# EAGLE design RF-Test-2 (EAGLE 6.4)
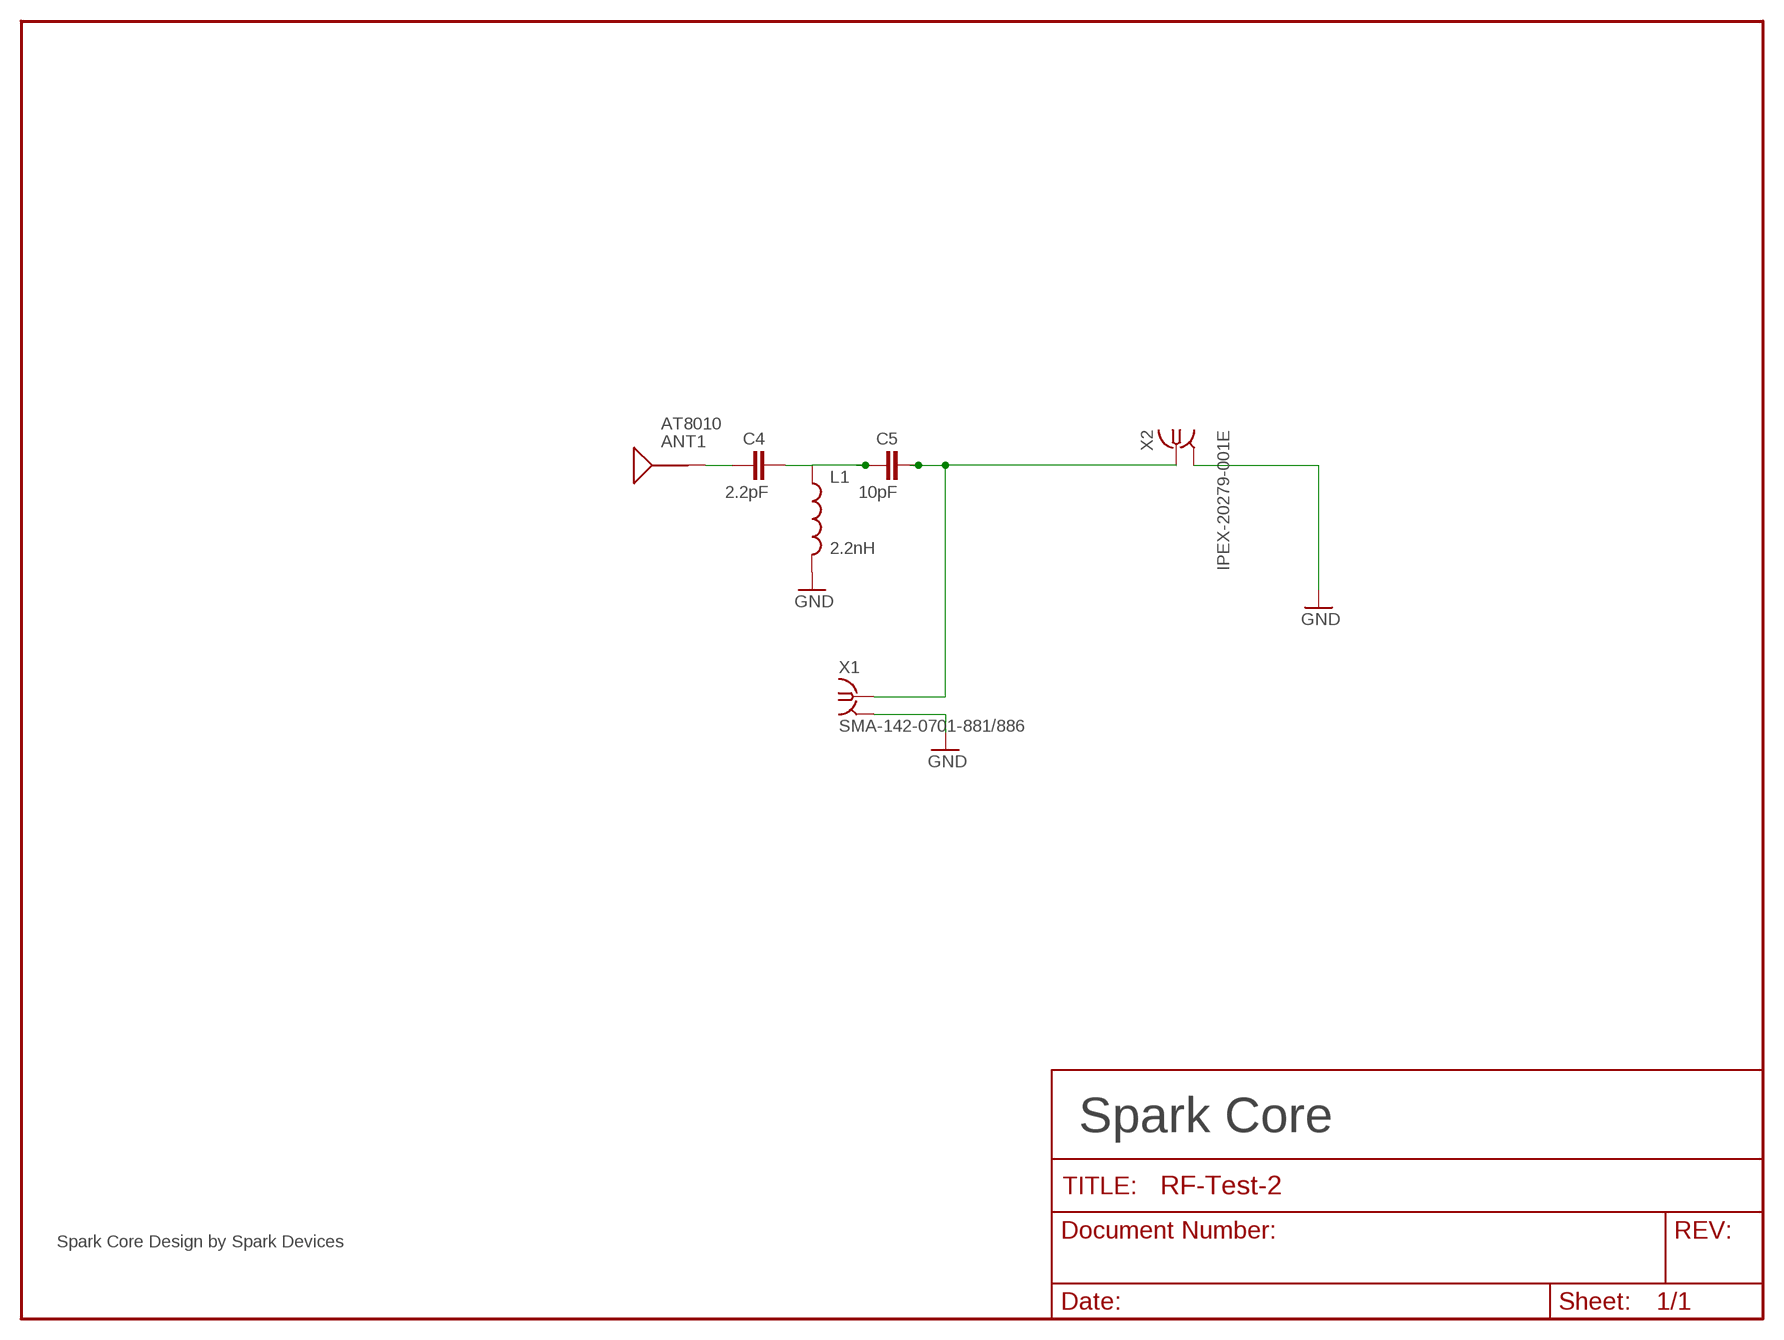
[diagram p0: schematic, sheet 1]

## Parts
ANT1  AT8010  [AT8010]
C4  2.2pF  C-EUC0603  [C0603]
C5  10pF  C-EUC0603  [C0603]
L1  2.2nH  INDUCTOR0603  [0603]
X1  SMA-142-0701-881/886  [ANDYW-GENERIC-END-LAUNCH]
X2  IPEX-20279-001E  [IPEX-20279-001E]

## Nets
GND [vcc]: L1.2 X1.G@1 X1.G@2 X1.G@3 X1.G@4 X2.2@1(GND) X2.2@2(GND)
N$3 [RF]: ANT1.SIG(SIGNAL) C4.1
N$4 [RF]: C5.2 X1.1 X2.1
N$5 [RF]: C4.2 C5.1 L1.1

## Notes on the sheet
- Spark Core
- Spark Core Design by Spark Devices

## Library data of the parts
ANT1 = Spark:AT8010: AT8010 Series Multilayer Chip Antenna
C4 C5 = rcl:C-EU: CAPACITOR, European symbol
L1 = SparkFun-Passives:INDUCTOR: Inductors Basic Inductor/Choke - 0603 and 1206. Footprints are not proven and vary greatly between part numbers.
X1 = andyw-oct-2011:SMA-: SMA 50 Ohm End Launch Jack Receptacle - Round Contact Johnson Components Source: www.johnsoncomponents.com .. J502-ND.pdf; MF: JOHNSON COMPONENTS; MPN: 142-0701-881; OC_FARNELL: 1608603; OC_NEWARK: 08B906
X2 = Spark:IPEX-20279-001E: Ultra Miniature Coaxial SMT RF Receptacle

## Net classes
2 RF: width 0.635 mm, clearance 0.635 mm
3 RF2: width 0.584 mm, clearance 1.143 mm

## Board
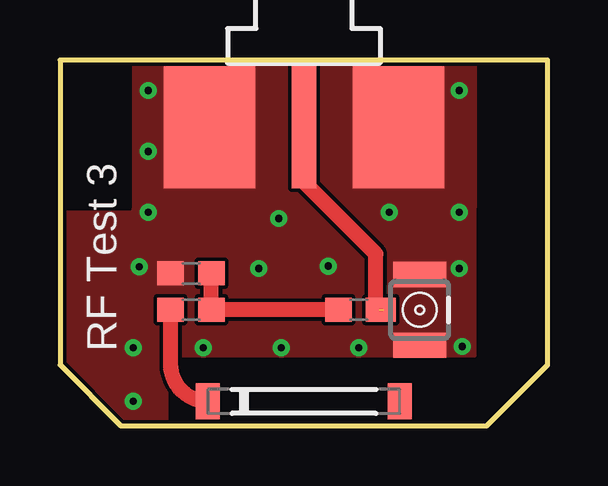
[diagram p1: board, top side]
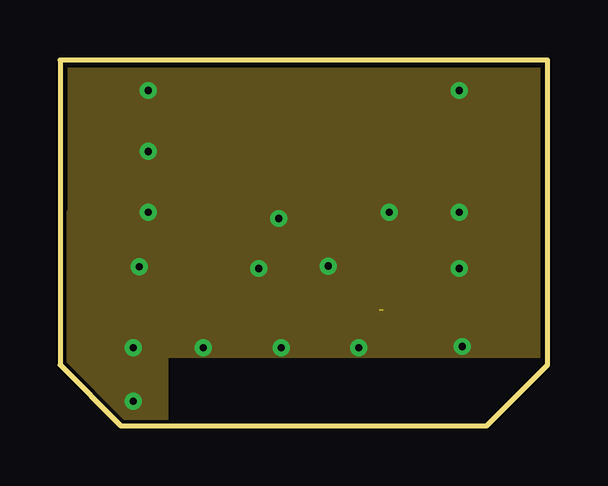
[diagram p2: board, inner layer $GND]
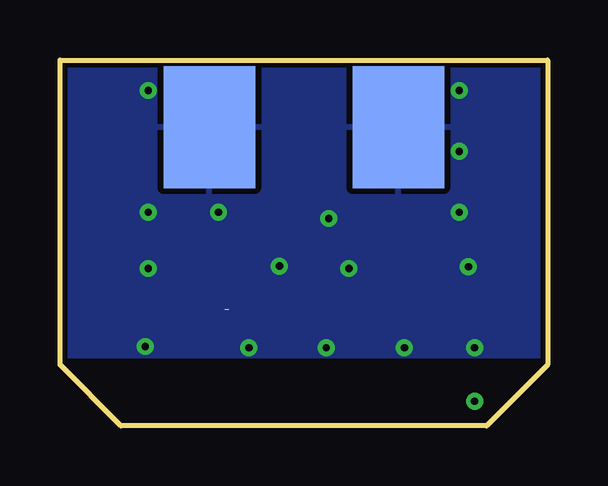
[diagram p3: board, bottom side, seen from below]

Size 20.32 x 15.24 mm. Coordinates in mm from the lower left corner, seen from the top.
Outline: 0,15.24 0,2.54 2.54,0 17.78,0 20.32,2.54 20.32,15.24 0,15.24
Copper layers (1+2*15+16): Top 0.035mm / dielectric 1.5mm / $GND 0.035mm / dielectric 0.15mm / $+3V3 0.035mm / dielectric 0.2mm / Bottom 0.035mm
Design rules "spark": minimum track width 6mil, minimum drill 0.3mm, track to track 6mil, track to pad 6mil, pad to pad 6mil, via to via 6mil, smd to smd 6mil, copper to edge 6mil, drill to drill 6mil, minimum pad ring 12mil, minimum via ring 8mil, stop-mask expansion 4mil, vias tented up to drill 20mil, thermal gap 10mil

### Footprints (pad centres in the part's own frame; a part is rotated, then mirrored left to right if it is on the bottom)
AT8010 = smd 1 x 1.5: NC -4,0; SIG 4,0
C0603 = smd 1.1 x 1: 1 -0.85,0; 2 0.85,0
0603 = smd 1.1 x 1: 1 -0.85,0; 2 0.85,0
ANDYW-GENERIC-END-LAUNCH = smd 5.08 x 1.016: 1 2.565,0 | smd 5.08 x 3.81: G@1 2.565,3.937; G@2 2.565,-3.937 | smd 5.08 x 3.81 bottom: G@3 2.565,3.937; G@4 2.565,-3.937
IPEX-20279-001E = smd 1 x 1.05: 1 0,1.528 | smd 1.05 x 2.2: 2@1 -1.475,0; 2@2 1.475,0

### Placement (x,y rotation side)
ANT1  10.16,1.02 180 top
C4  5.46,4.83 0 top
C5  12.45,4.83 0 top
L1  5.46,6.35 180 top
X1  10.16,15.01 270 top
X2  14.99,4.83 90 top

### Tracks (layer width: path | path; a pad name or v marks a point on that pad's centre or on a via)
GND  (via drill 0.3)
  other vias: 3.3,6.63 3.05,1.02 3.05,3.25 3.68,13.97 3.68,11.43 16.64,13.97 16.64,8.89 13.72,8.89 3.68,8.89 9.12,8.64 5.97,3.25 9.22,3.25 12.45,3.25 16.76,3.3 16.64,6.55 11.18,6.65 8.28,6.55
  pour $GND (isolate 0.203): 0,15.24 20.32,15.24 20.32,2.92 0,2.92
  pour Top (no thermals): 3.05,2.92 3.07,15.24 17.3,15.24 17.27,2.92
  pour $GND: 4.45,8.89 4.45,0 2.92,0 2.54,0 0.38,2.16 0,2.54 0,8.25 0,8.89
  pour Top: 4.45,8.89 4.45,0 2.92,0 2.54,0 0.38,2.16 0,2.54 0,8.25 0,8.89
  pour Bottom (isolate 0.203): 0,15.24 20.32,15.24 20.32,2.92 0,2.92
N$3
  Top 0.635: ANT1.SIG arc-90 4.61,2.56 C4.1
N$4  (1 unrouted)
  Top 0.635: C5.2 arc-90 13.16,4.96 13.16,7.16 10.16,10.16 X1.1
N$5
  Top 0.635: C5.1 C4.2 L1.1

### Text on the board
tPlace: RF Test 3